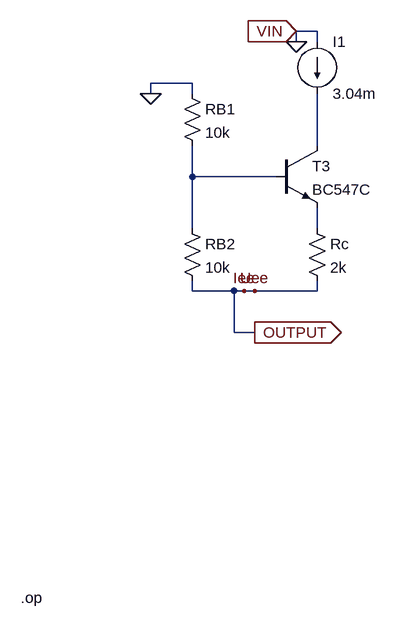
[diagram p0: schematic Draft2.asc]
Draft2.asc, the LTspice schematic file:
Version 4
SHEET 1 880 904
WIRE 400 16 368 16
WIRE 368 32 368 16
WIRE 400 32 400 16
WIRE 208 96 144 96
WIRE 144 112 144 96
WIRE 208 112 208 96
WIRE 400 192 400 112
WIRE 208 240 208 192
WIRE 336 240 208 240
WIRE 208 320 208 240
WIRE 400 320 400 288
WIRE 208 416 208 400
WIRE 272 416 208 416
WIRE 288 416 272 416
WIRE 304 416 288 416
WIRE 400 416 400 400
WIRE 400 416 304 416
WIRE 272 480 272 416
WIRE 304 480 272 480
FLAG 144 112 0
FLAG 304 416 Uee
FLAG 368 32 0
FLAG 288 416 Iee
FLAG 304 480 OUTPUT
IOPIN 304 480 Out
FLAG 368 16 VIN
IOPIN 368 16 In
SYMBOL res 192 96 R0
SYMATTR InstName RB1
SYMATTR Value 10k
SYMBOL res 192 304 R0
SYMATTR InstName RB2
SYMATTR Value 10k
SYMBOL npn 336 192 R0
SYMATTR InstName T3
SYMATTR Value BC547C
SYMBOL res 384 304 R0
SYMATTR InstName Rc
SYMATTR Value 2k
SYMBOL current 400 32 R0
WINDOW 123 0 0 Left 2
WINDOW 39 0 0 Left 2
SYMATTR InstName I1
SYMATTR Value 3.04m
TEXT -56 888 Left 2 !.op

The netlist it stands for:
* Draft2.asc
RB1 0 N002 10k
RB2 N002 OUTPUT 10k
Q§T3 N001 N002 N003 0 BC547C
Rc N003 OUTPUT 2k
I1 0 N001 3.04m
.model NPN NPN
.model PNP PNP
.lib standard.bjt
.op
.backanno
.end